# Altium schematic sheet Sensor_Power_Supply.SchDoc
size A3
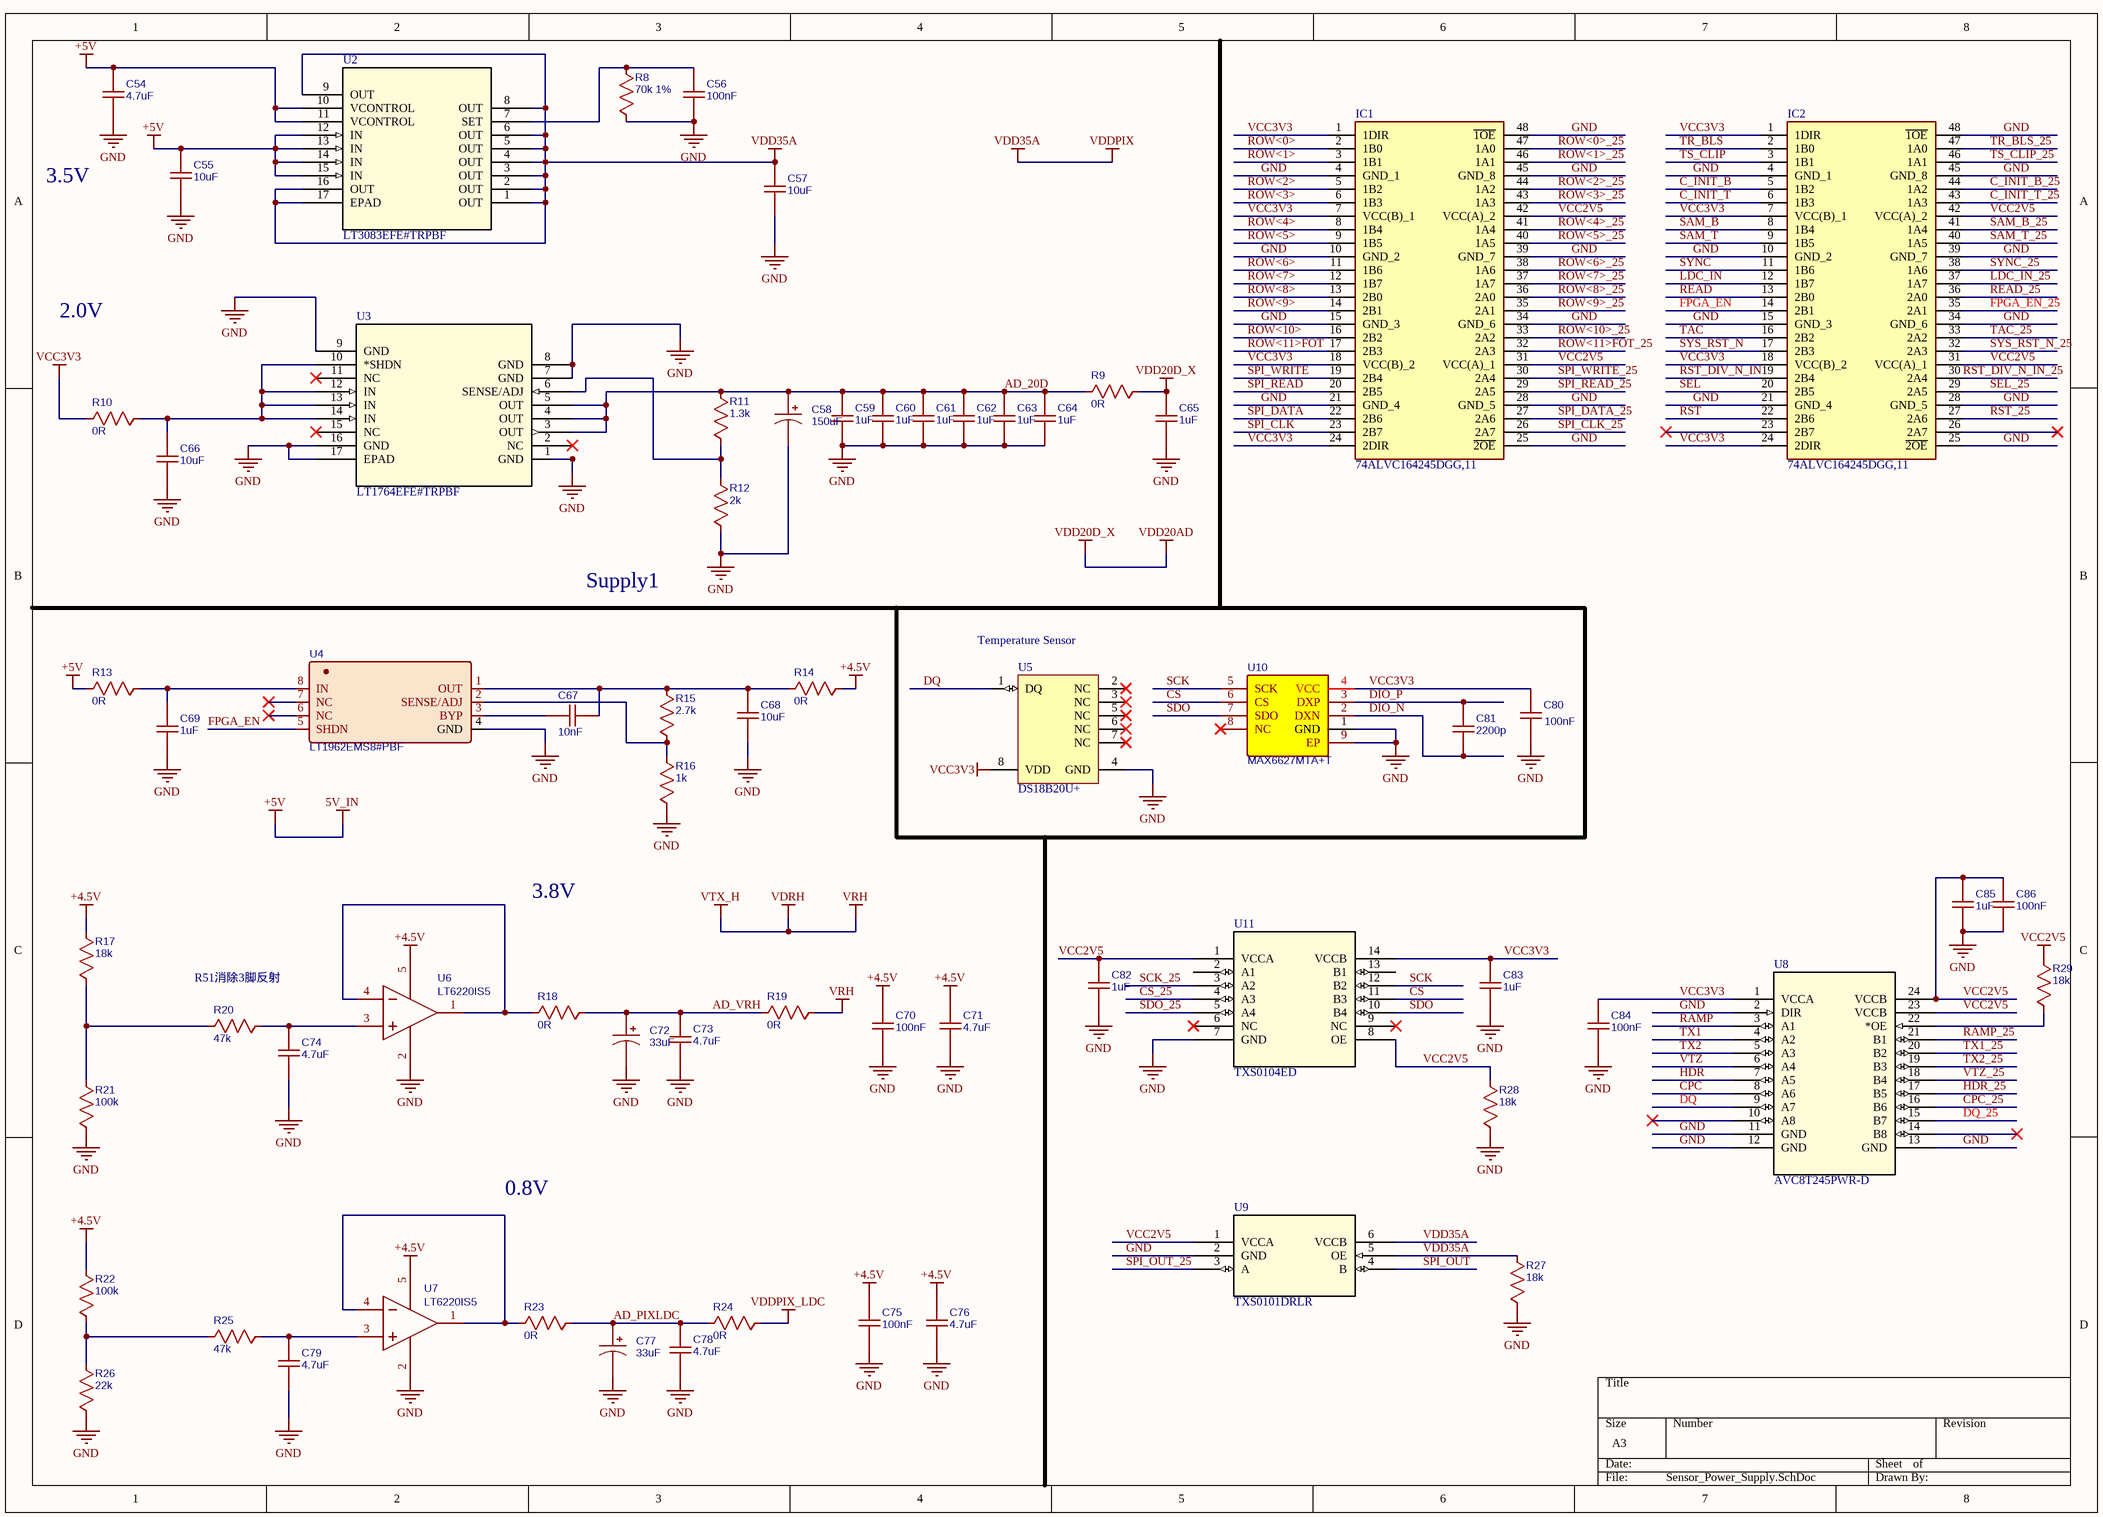
[diagram p0: Sensor_Power_Supply.SchDoc]

## Parts
C54  4.7uF  [C0603]
C55  10uF  [C0603]
C56  100nF  [C0603]
C57  10uF  [CAP0402]
C58  150uF  [CASE-A_3216]
C59  1uF  [C0603]
C60  1uF  [C0603]
C61  1uF  [C0603]
C62  1uF  [C0603]
C63  1uF  [C0603]
C64  1uF  [C0603]
C65  1uF  [C0603]
C66  10uF  [C0603]
C67  10nF  [CAP0402]
C68  10uF  [C0603]
C69  1uF  [C0603]
C70  100nF  [C0603]
C71  4.7uF  [C0603]
C72  33uF  [CASE-A_3216]
C73  4.7uF  [C0603]
C74  4.7uF  [C0603]
C75  100nF  [C0603]
C76  4.7uF  [C0603]
C77  33uF  [CASE-A_3216]
C78  4.7uF  [C0603]
C79  4.7uF  [C0603]
C80  100nF  [C0603]
C81  2200p  [C0603]
C82  1uF  [CAP0402]
C83  1uF  [CAP0402]
C84  100nF  [CAP0402]
C85  1uF  [CAP0402]
C86  100nF  [CAP0402]
IC1  74ALVC164245DGG,11  [SOP50P810X120-48N]
IC2  74ALVC164245DGG,11  [SOP50P810X120-48N]
R8  70k 1%  [R0603]
R9  0R  [R0603]
R10  0R  [R0603]
R11  1.3k  [R0603]
R12  2k  [R0603]
R13  0R  [R0603]
R14  0R  [R0603]
R15  2.7k  [RES0402]
R16  1k  [RES0402]
R17  18k  [R0603]
R18  0R  [RES0402]
R19  0R  [R0603]
R20  47k  [R0603]
R21  100k  [R0603]
R22  100k  [R0603]
R23  0R  [RES0402]
R24  0R  [R0603]
R25  47k  [R0603]
R26  22k  [R0603]
R27  18k  [RES0402]
R28  18k  [R0603]
R29  18k  [RES0402]
U2  LT3083EFE#TRPBF  [TSSOP-16_FE/BB]
U3  LT1764EFE#TRPBF  [TSSOP-16_FE/BB]
U4  LT1962EMS8#PBF  [MSOP-8_L3.0-W3.0-P0.65-LS5.0-TL]
U5  DS18B20U+  [MAXM-U8+1_N]
U6  LT6220IS5  [SOT23-5]
U7  LT6220IS5  [SOT23-5]
U8  AVC8T245PWR-D  [PW24]
U9  TXS0101DRLR  [DRL6]
U10  MAX6627MTA+T  [MAXM-T833+2_V]
U11  TXS0104ED  [D14]

## Nets
+4.5V: C70.2 C71.2 C75.2 C76.2 R14.2 R17.2 R22.2 U6.5(VS+) U7.5(VS+)
+5V: C54.2 C55.2 R13.1 U2.10(VCONTROL) U2.11(VCONTROL) U2.12(IN) U2.13(IN) U2.14(IN) U2.15(IN)  [also labelled 5V_IN]
GND: C54.1 C55.1 C56.1 C57.1 C58.2 C59.1 C60.1 C61.1 C62.1 C63.1 C64.1 C65.1 C66.1 C68.2 C69.1 C70.1 C71.1 C72.2 C73.1 C74.1 C75.1 C76.1 C77.2 C78.1 C79.1 C80.1 C82.1 C83.1 C84.1 C85.1 C86.1 IC1.4(GND_1) IC1.10(GND_2) IC1.15(GND_3) IC1.21(GND_4) IC1.25(~{2OE}) IC1.28(GND_5) IC1.34(GND_6) IC1.39(GND_7) IC1.45(GND_8) IC1.48(~{1OE}) IC2.4(GND_1) IC2.10(GND_2) IC2.15(GND_3) IC2.21(GND_4) IC2.25(~{2OE}) IC2.28(GND_5) IC2.34(GND_6) IC2.39(GND_7) IC2.45(GND_8) IC2.48(~{1OE}) R8.1 R12.1 R16.1 R21.1 R26.1 R27.1 R28.1 U3.1(GND) U3.7(GND) U3.8(GND) U3.9(GND) U3.16(GND) U3.17(EPAD) U4.4(GND) U5.4(GND) U6.2(VS-) U7.2(VS-) U8.2(DIR) U8.11(GND) U8.12(GND) U8.13(GND) U9.2(GND) U10.1(GND) U10.9(EP) U11.7(GND)
VCC2V5: C82.2 C85.2 C86.2 IC1.31(VCC(A)_1) IC1.42(VCC(A)_2) IC2.31(VCC(A)_1) IC2.42(VCC(A)_2) R28.2 R29.2 U8.23(VCCB) U8.24(VCCB) U9.1(VCCA) U11.1(VCCA) U11.8(OE)
VCC3V3: C80.2 C83.2 C84.2 IC1.1(1DIR) IC1.7(VCC(B)_1) IC1.18(VCC(B)_2) IC1.24(2DIR) IC2.1(1DIR) IC2.7(VCC(B)_1) IC2.18(VCC(B)_2) IC2.24(2DIR) R10.1 U5.8(VDD) U8.1(VCCA) U10.4(VCC) U11.14(VCCB)
VDD20AD: C65.2 R9.2  [also labelled VDD20D_X]
VDD35A: C57.2 R27.2 U2.1(OUT) U2.2(OUT) U2.3(OUT) U2.4(OUT) U2.5(OUT) U2.6(OUT) U2.8(OUT) U2.9(OUT) U2.16(OUT) U2.17(EPAD) U9.5(OE) U9.6(VCCB)  [also labelled VDDPIX]
VDDPIX_LDC: R24.2
VDRH: R19.2  [also labelled VRH, VTX_H]
AD_20D: C58.1 C59.2 C60.2 C61.2 C62.2 C63.2 C64.2 R9.1 R11.2 U3.3(OUT) U3.4(OUT) U3.5(OUT)
AD_PIXLDC: C77.1 C78.2 R23.2 R24.1
AD_VRH: C72.1 C73.2 R18.2 R19.1
C_INIT_B: IC2.5(1B2)
C_INIT_B_25: IC2.44(1A2)
C_INIT_T: IC2.6(1B3)
C_INIT_T_25: IC2.43(1A3)
CPC: U8.8(A6)
CPC_25: U8.16(B6)
CS: U10.6(CS) U11.11(B3)
CS_25: U11.4(A3)
DIO_N: C81.1 U10.2(DXN)
DIO_P: C81.2 U10.3(DXP)
DQ: U5.1(DQ) U8.9(A7)
DQ_25: U8.15(B7)
FPGA_EN: IC2.14(2B1) U4.5(SHDN)
FPGA_EN_25: IC2.35(2A1)
HDR: U8.7(A5)
HDR_25: U8.17(B5)
LDC_IN: IC2.12(1B7)
LDC_IN_25: IC2.37(1A7)
RAMP: U8.3(A1)
RAMP_25: U8.21(B1)
READ: IC2.13(2B0)
READ_25: IC2.36(2A0)
ROW<0>: IC1.2(1B0)
ROW<0>_25: IC1.47(1A0)
ROW<1>: IC1.3(1B1)
ROW<1>_25: IC1.46(1A1)
ROW<2>: IC1.5(1B2)
ROW<2>_25: IC1.44(1A2)
ROW<3>: IC1.6(1B3)
ROW<3>_25: IC1.43(1A3)
ROW<4>: IC1.8(1B4)
ROW<4>_25: IC1.41(1A4)
ROW<5>: IC1.9(1B5)
ROW<5>_25: IC1.40(1A5)
ROW<6>: IC1.11(1B6)
ROW<6>_25: IC1.38(1A6)
ROW<7>: IC1.12(1B7)
ROW<7>_25: IC1.37(1A7)
ROW<8>: IC1.13(2B0)
ROW<8>_25: IC1.36(2A0)
ROW<9>: IC1.14(2B1)
ROW<9>_25: IC1.35(2A1)
ROW<10>: IC1.16(2B2)
ROW<10>_25: IC1.33(2A2)
ROW<11>FOT: IC1.17(2B3)
ROW<11>FOT_25: IC1.32(2A3)
RST: IC2.22(2B6)
RST_25: IC2.27(2A6)
RST_DIV_N_IN: IC2.19(2B4)
RST_DIV_N_IN_25: IC2.30(2A4)
SAM_B: IC2.8(1B4)
SAM_B_25: IC2.41(1A4)
SAM_T: IC2.9(1B5)
SAM_T_25: IC2.40(1A5)
SCK: U10.5(SCK) U11.12(B2)
SCK_25: U11.3(A2)
SDO: U10.7(SDO) U11.10(B4)
SDO_25: U11.5(A4)
SEL: IC2.20(2B5)
SEL_25: IC2.29(2A5)
SPI_CLK: IC1.23(2B7)
SPI_CLK_25: IC1.26(2A7)
SPI_DATA: IC1.22(2B6)
SPI_DATA_25: IC1.27(2A6)
SPI_OUT: U9.4(B)
SPI_OUT_25: U9.3(A)
SPI_READ: IC1.20(2B5)
SPI_READ_25: IC1.29(2A5)
SPI_WRITE: IC1.19(2B4)
SPI_WRITE_25: IC1.30(2A4)
SYNC: IC2.11(1B6)
SYNC_25: IC2.38(1A6)
SYS_RST_N: IC2.17(2B3)
SYS_RST_N_25: IC2.32(2A3)
TAC: IC2.16(2B2)
TAC_25: IC2.33(2A2)
TR_BLS: IC2.2(1B0)
TR_BLS_25: IC2.47(1A0)
TS_CLIP: IC2.3(1B1)
TS_CLIP_25: IC2.46(1A1)
TX1: U8.4(A2)
TX1_25: U8.20(B2)
TX2: U8.5(A3)
TX2_25: U8.19(B3)
VTZ: U8.6(A4)
VTZ_25: U8.18(B4)
NetC56_2: C56.2 R8.2 U2.7(SET)
NetC66_2: C66.2 R10.2 U3.10(*SHDN) U3.12(IN) U3.13(IN) U3.14(IN)
NetC67_1: C67.1 C68.1 R14.1 R15.2 U4.1(OUT)
NetC67_2: C67.2 U4.3(BYP)
NetC69_2: C69.2 R13.2 U4.8(IN)
NetC74_2: C74.2 R20.2 U6.3(+IN)
NetC79_2: C79.2 R25.2 U7.3(+IN)
NetR11_1: R11.1 R12.2 U3.6(SENSE/ADJ)
NetR15_1: R15.1 R16.2 U4.2(SENSE/ADJ)
NetR17_1: R17.1 R20.1 R21.2
NetR18_1: R18.1 U6.1(VOUT) U6.4(-IN)
NetR22_1: R22.1 R25.1 R26.2
NetR23_1: R23.1 U7.1(VOUT) U7.4(-IN)
NetR29_1: R29.1 U8.22(*OE)

Not connected (* = marked no-connect by the designer): IC2 23(2B7)* 26(2A7)*; U3 2(NC)* 11(NC)* 15(NC)*; U4 6(NC)* 7(NC)*; U5 2(NC)* 3(NC)* 5(NC)* 6(NC)* 7(NC)*; U8 10(A8)* 14(B8)*; U10 8(NC)*; U11 2(A1) 6(NC)* 9(NC)* 13(B1)

## Notes on the sheet
- 3.5V
- 2.0V
- Supply1
- (near U5) Temperature Sensor
- 3.8V
- (near R20) R51消除3脚反射
- 0.8V

## Library data of the parts
C54-C57 C66 C68 = 10u: nameAlias: Value(F); Contributor: LCEDA_Lib; spicePre: C; spiceSymbolName: C_0603_US
C58 = 150u: nameAlias: Value(F); Contributor: LCEDA_Lib; spicePre: C; spiceSymbolName: C_Tan_SMD_A_US
C59-C65 C69 C82-C86 = 1u: nameAlias: Value(F); Contributor: LCEDA_Lib; spicePre: C; spiceSymbolName: C_0603_US
C67 = 10n: nameAlias: Value(F); Contributor: LCEDA_Lib; spicePre: C; spiceSymbolName: C_0603_US
C70 C75 C80 = 100n: nameAlias: Value(F); Contributor: LCEDA_Lib; spicePre: C; spiceSymbolName: C_0603_US
C71 C73 C74 C76 C78 C79 = 4.7u: nameAlias: Value(F); Contributor: LCEDA_Lib; spicePre: C; spiceSymbolName: C_0603_US
C72 C77 = 33u: nameAlias: Value(F); Contributor: LCEDA_Lib; spicePre: C; spiceSymbolName: C_Tan_SMD_A_US
C81 = 2200p: nameAlias: Value(F); Contributor: LCEDA_Lib; spicePre: C; spiceSymbolName: C_0603_US
IC1 IC2 = 74ALVC164245DGG,11: Integrated Circuit; Manufacturer_Name: Nexperia; Datasheet Link: https://assets.nexperia.com/documents/data-sheet/74ALVC164245.pdf; Height: 1.2mm; Manufacturer_Part_Number: 74ALVC164245DGG,11; Mouser Part Number: 771-74ALVC16424; Mouser Price/Stock: https://www.mouser.co.uk/ProductDetail/Nexperia/74ALVC164245DGG11/?qs=odJ8N4Y39o7U7wQRxrnAkg%3D%3D; Arrow Part Number: 74ALVC164245DGG,11; Arrow Price/Stock: https://www.arrow.com/en/products/74alvc164245dgg11/nexperia
R8-R10 R13 R14 R18 R19 R23 R24 = 0R: nameAlias: Value(Ω); Contributor: LCEDA_Lib; spicePre: R; spiceSymbolName: R_0603_US
R11 R12 R15 = 1k: nameAlias: Value(Ω); Contributor: LCEDA_Lib; spicePre: R; spiceSymbolName: R_0603_US
R16 = 2.7k: nameAlias: Value(Ω); Contributor: LCEDA_Lib; spicePre: R; spiceSymbolName: R_0603_US
R17 = 22k: nameAlias: Value(Ω); Contributor: LCEDA_Lib; spicePre: R; spiceSymbolName: R_0603_US
R20 R22 R25 R26 = 47k: nameAlias: Value(Ω); Contributor: LCEDA_Lib; spicePre: R; spiceSymbolName: R_0603_US
R21 = 100k: nameAlias: Value(Ω); Contributor: LCEDA_Lib; spicePre: R; spiceSymbolName: R_0603_US
R27-R29 = 18k: nameAlias: Value(Ω); Contributor: LCEDA_Lib; spicePre: R; spiceSymbolName: R_0603_US
U2 = LT3083EFE#TRPBF: LDO for 3V5; Vendor: Linear Technology; Manufacturer_Part_Number: lt3083efe#trpbf; Copyright: Copyright (C) 2018 Accelerated Designs. All rights reserved; RefDes: RefDes; Type: DEV
U3 = LT1764EFE#TRPBF: LDO for 2V; Vendor: Linear Technology; Manufacturer_Part_Number: lt1764efe#trpbf; Copyright: Copyright (C) 2018 Accelerated Designs. All rights reserved; RefDes: RefDes; Type: DEV
U4 = LT1962EMS8#PBF: BOM_Manufacturer: Linear Tech; Contributor: LCSC; SMT Type: Extend; BOM_Supplier: LCSC; BOM_Supplier Part: C136801; BOM_Manufacturer Part: LT1962EMS8#PBF; BOM_JLCPCB SMD: Yes; spicePre: U; spiceSymbolName: LT1962EMS8#PBF
U5 = DS18B20U+: High-Precision 1-Wire Digital Thermometer, -55 to 125 degC, 8-Pin SOP (U8+1), Pb-Free; Sensor Type: Local; Multi Droppable: Yes; Temp. Thresh.: Programmable (NV); ComponentLink1Description: Manufacturer URL; ComponentLink2Description: Datasheet; DatasheetVersion: Rev. 4; Generic Part Number: DS18B20; ComponentLink3URL: http://pdfserv.maximintegrated.com/package_dwgs/21-0036.PDF; ComponentLink3Description: Package Specification; ComponentLink1URL: http://www.maximintegrated.com/; ComponentLink2URL: http://datasheets.maximintegrated.com/en/ds/DS18B20.pdf; Code_JEDEC: MO-187; PackageVersion: Rev. L, 08/2009; Parasite Pwr.: Yes; Interface: 1-Wire; PartNumber: DS18B20U+; PackageDescription: 8-Pin Micro-MAX, Thin Shrink Small-Outline (U8+1), Body 3 x 3 mm, Pitch 0.65 mm; Mounting Technology: Surface Mount; RoHS: Pb-Free; PackageReference: U8+1
U8 = AVC8T245PWR-D: 8-Bit Dual-Supply Bus Transceiver with Configurable Voltage Translation and 3-State Outputs; Manufacturer: Texas Instruments; GENERIC_PART_NUMBER: SN74AVC8T245; INDUSTRY_STD_PKG_TYPE: TSSOP; FAMILY_NAME: DIRECTION CONTROL DUAL SUPPLY TRANSLATOR; PIN_COUNT: 24; PACKAGE_DESIGNATOR: PW; Datasheet_URL: http://www.ti.com/lit/gpn/SN74AVC8T245; Vendor: Texas Instruments; Manufacturer_Part_Number: AVC8T245PWR-D; Copyright: Copyright (C) 2018 Accelerated Designs. All rights reserved; RefDes: RefDes; Type: DEV
U9 = TXS0101DRLR: 1-Bit Bidirectional Voltage-Level Translator for Open-Drain Application; Vendor: Texas Instruments; PACKAGE_DESIGNATOR: DRL; PIN_COUNT: 6; FAMILY_NAME: AUTO DIRECTION SENSING DUAL SUPPLY TRANSLATOR; INDUSTRY_STD_PKG_TYPE: SOT; Manufacturer_Part_Number: TXS0101DRLR; GENERIC_PART_NUMBER: TXS0101; Datasheet_URL: http://www.ti.com/lit/gpn/TXS0101; Manufacturer: Texas Instruments; Copyright: Copyright (C) 2018 Accelerated Designs. All rights reserved; RefDes: RefDes; Type: DEV
U11 = TXS0104ED: 4-Bit Bidirectional Voltage-Level Translator for Open-Drain Applications; Vendor: Texas Instruments; PACKAGE_DESIGNATOR: D; PIN_COUNT: 14; FAMILY_NAME: AUTO DIRECTION SENSING DUAL SUPPLY TRANSLATOR; INDUSTRY_STD_PKG_TYPE: SOIC; Manufacturer_Part_Number: TXS0104ED; GENERIC_PART_NUMBER: TXS0104E; Datasheet_URL: http://www.ti.com/lit/gpn/TXS0104E; Manufacturer: Texas Instruments; Copyright: Copyright (C) 2018 Accelerated Designs. All rights reserved; RefDes: RefDes; Type: DEV
U6 U7 = LT6220IS5: spicePre: U; spiceSymbolName: LT6220IS5
U10 = MAX6627MTA+T: spicePre: U; spiceSymbolName: MAX6627MTA+T